# Altium schematic sheet [04]_Power Sheet.SchDoc
size Legal; DocumentNumber: 4; SheetNumber: 4; SheetTotal: 5
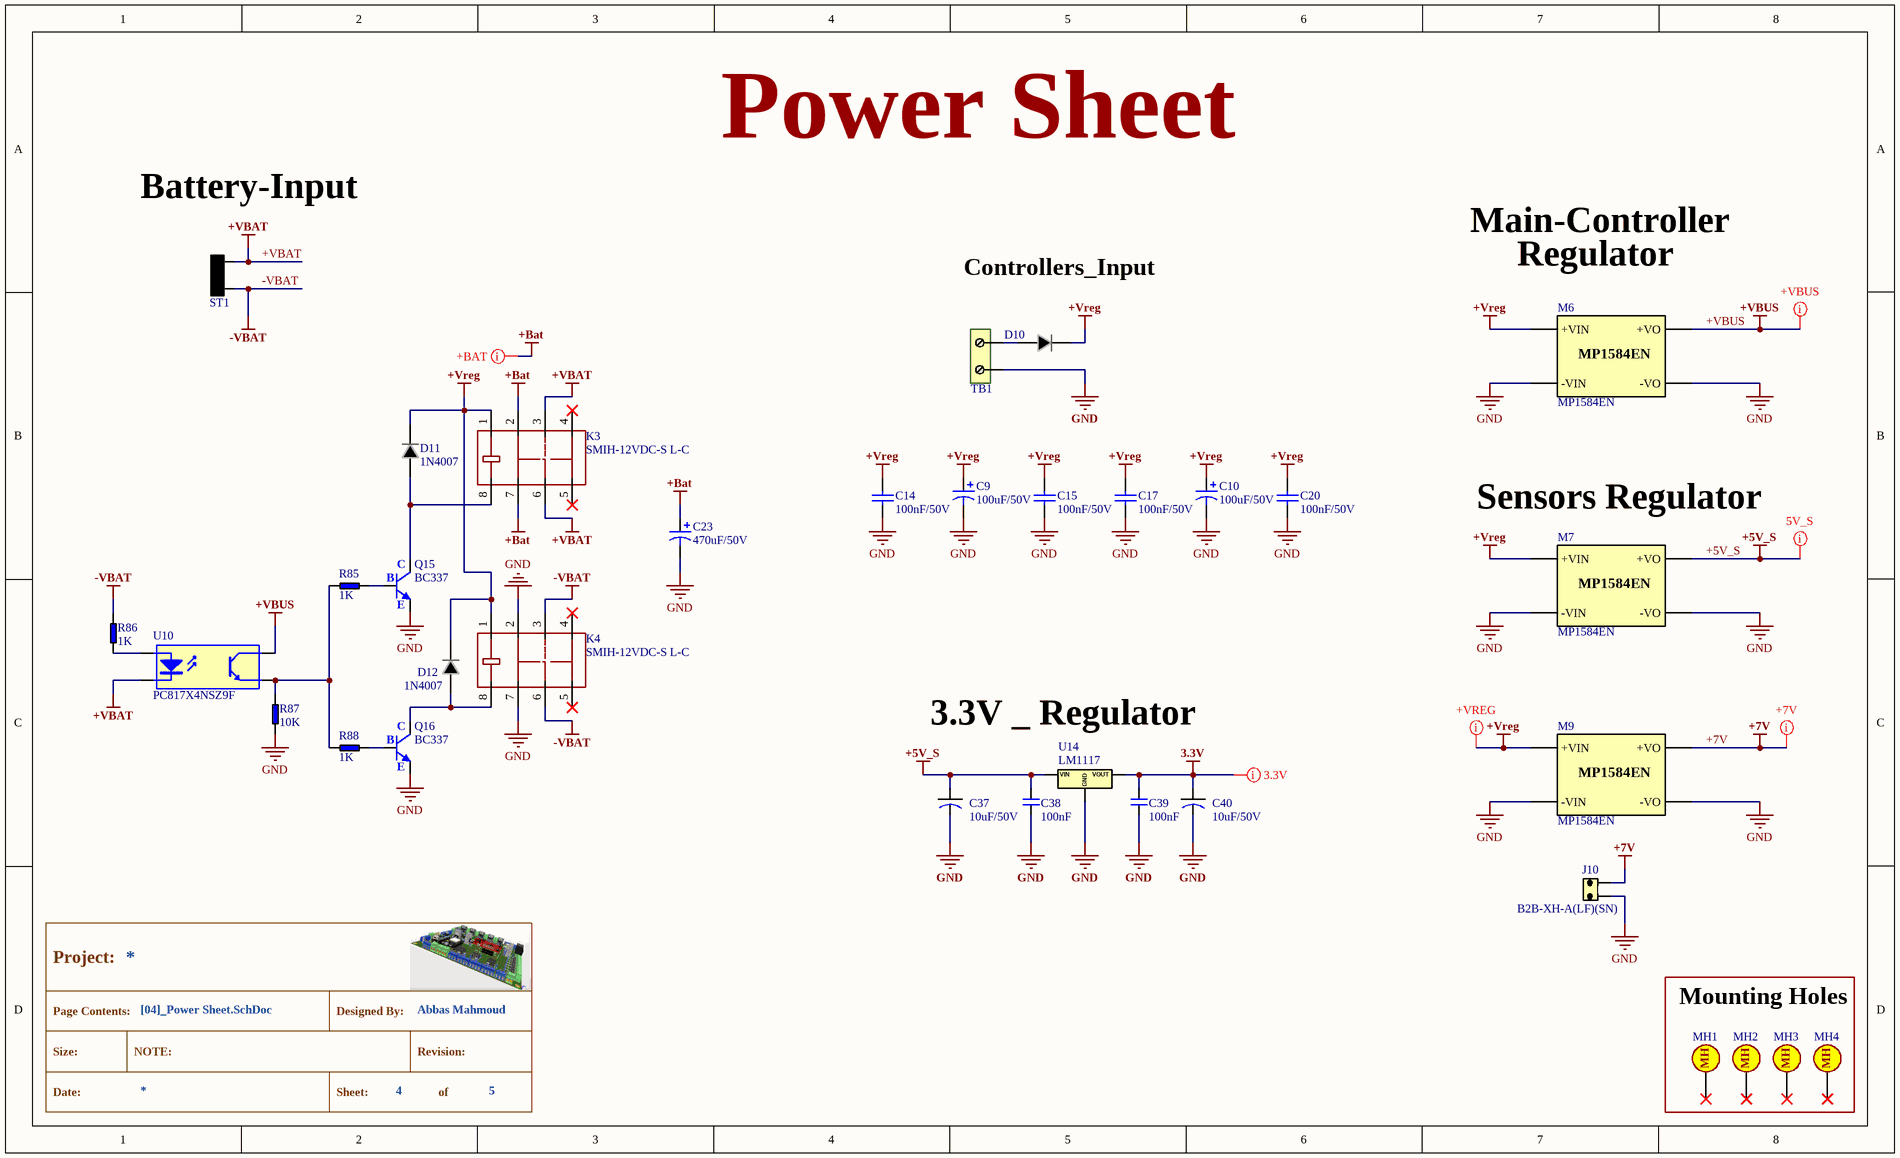
[diagram p0: [04]_Power Sheet.SchDoc]

## Parts
*  Title Block  (value not drawn)  (graphical)
C9  100uF/50V  [ECAP - THT - 8X12X3.5MM]
C10  100uF/50V  [ECAP - THT - 8X12X3.5MM]
C14  100nF/50V  [CCAP - PACKAGE - THT ,P = 2.54 MM]
C15  100nF/50V  [CCAP - PACKAGE - THT ,P = 2.54 MM]
C17  100nF/50V  [CCAP - PACKAGE - THT ,P = 2.54 MM]
C20  100nF/50V  [CCAP - PACKAGE - THT ,P = 2.54 MM]
C23  470uF/50V  [ECAP - THT - 10X20X5MM]
C37  10uF/50V  [ECAP 5X11X2MM]
C38  100nF  [CCAP 0.1 N Y]
C39  100nF  [CCAP 0.1 N Y]
C40  10uF/50V  [ECAP 5X11X2MM]
D10  1N4007  [DIODE - THT - 10.16P - PACKAGE - DO-41]  (value not drawn)
D11  1N4007  [DIODE - THT - 7.62P - PACKAGE - DO-41]
D12  1N4007  [DIODE - THT - 7.62P - PACKAGE - DO-41]
J10  B2B-XH-A(LF)(SN)  [XH - 2P - Vertical - Package - THT - P = 2.54]
K3  SMIH-12VDC-S L-C  [RELAY-TH_SMIH-12VDC-SL-C]
K4  SMIH-12VDC-S L-C  [RELAY-TH_SMIH-12VDC-SL-C]
M6  MP1584EN  [DC TO D CCONVERTER - MP1584]
M7  MP1584EN  [DC TO D CCONVERTER - MP1584]
M9  MP1584EN  [DC TO D CCONVERTER - MP1584]
MH1  MOUNTING HOLE  [MH-3.2X8mm_Round]  (value not drawn)  (no BOM)
MH2  MOUNTING HOLE  [MH-3.2X8mm_Round]  (value not drawn)  (no BOM)
MH3  MOUNTING HOLE  [MH-3.2X8mm_Round]  (value not drawn)  (no BOM)
MH4  MOUNTING HOLE  [MH-3.2X8mm_Round]  (value not drawn)  (no BOM)
Q15  BC337  [Transistor - THT - PACKAGE - TO-92 / TO-92-3]
Q16  BC337  [Transistor - THT - PACKAGE - TO-92 / TO-92-3]
R85  1K  [R - THT - P5.0 - 1/4W]
R86  1K  [R - THT - P5.0 - 1/4W]
R87  10K  [R - THT - P5.0 - 1/4W]
R88  1K  [R - THT - P5.0 - 1/4W]
ST1  SCREW TERMINAL  [SCREW TERMINAL]  (value not drawn)
TB1  2 Pins Pluggable  [TERMINAL BLOCK - 2 PINS - PACKAGE - PLUGGABLE - THT - P = 5.08MM - Horizontal _ Plug+Receptable]  (value not drawn)
U10  PC817X4NSZ9F  [ICB - DIP-4]
U14  LM1117  [V-REG/Heatsink - TO - 220]

## Blocks framed on the sheet
Mounting Holes: MH1-MH4

## Nets
3.3V: C39.1 C40.A U14.2(VOUT)
+5V_S: C37.A C38.1 M7.+VO U14.3(VIN)
+7V: J10.2 M9.+VO
+Bat: C23.A K3.2 K3.7
+VBAT: K3.3 K3.6 ST1.1(AC) U10.2(K)
+VBUS: M6.+VO U10.4(C)
+Vreg: C9.A C10.A C14.1 C15.1 C17.1 C20.1 D10.K D11.K D12.K K3.1 K4.1 M6.+VIN M7.+VIN M9.+VIN
-VBAT: K4.3 K4.6 R86.2 ST1.2(AC)
GND: C9.K C10.K C14.2 C15.2 C17.2 C20.2 C23.K C37.K C38.2 C39.2 C40.K J10.1 K4.2 K4.7 M6.-VIN M6.-VO M7.-VIN M7.-VO M9.-VIN M9.-VO Q15.1(E) Q16.1(E) R87.1 TB1.2 U14.1(GND)
NetD10_A: D10.A TB1.1
NetD11_A: D11.A K3.8 Q15.3(C)
NetD12_A: D12.A K4.8 Q16.3(C)
NetQ15_2: Q15.2(B) R85.2
NetQ16_2: Q16.2(B) R88.2
NetR85_1: R85.1 R87.2 R88.1 U10.3(E)
NetR86_1: R86.1 U10.1(A)

Not connected (* = marked no-connect by the designer): K3 4* 5*; K4 4* 5*; MH1 MH*; MH2 MH*; MH3 MH*; MH4 MH*

## Layout directives
rule Width Constraint [Pref Width = 5mm    Min Width = 0.5mm    Max Width = 5mm]: +Bat
rule Width Constraint [Pref Width = 2mm    Min Width = 2mm    Max Width = 2mm]: +Vreg
rule Width Constraint [Pref Width = 1.5mm    Min Width = 1.5mm    Max Width = 2mm]: 3.3V, +7V
rule Width Constraint [Pref Width = 1.5mm    Min Width = 0.5mm    Max Width = 2mm]: +VBUS
rule Width Constraint [Pref Width = 1.5mm    Min Width = 0.5mm    Max Width = 1.5mm]: +5V_S

## Notes on the sheet
- Power Sheet
- Battery-Input
- Main-Controller
- Controllers_Input
- Regulator
- (near M7) Sensors Regulator
- 3.3V _ Regulator
- (in symbol Title Block) Project:; Page Contents:; Designed By:; Abbas Mahmoud; Size:; NOTE:; Revision:; Date:; Sheet:; of

## Library data of the parts
* = Title Block: Moatley Title Block
C9 C10 = ECAP - 100uF - 50V: 100uF ±20% 50V 8x12 1000Hrs @ 105℃ Radial,8x12mm Aluminum Electrolytic Capacitors - Leaded RoHS
C14 C15 C17 C20 = CCAP - 100nF - 50V - THT - P = 2.54: 100nF -20%~+80% 50V Through Hole,P=2.54mm Ceramic Disc Capacitors RoHS; Parameter 1: *; Parameter 2: *; Parameter 3: *
C23 = ECAP - 470uF - 50V: 470uF ±20% 50V 10x20 1000Hrs @ 105℃ Radial,10x20mm Aluminum Electrolytic Capacitors - Leaded RoHS
C37 C40 = ECAP-10uF-50V: 10uF ±20% 50V 5x11 1000Hrs @ 105℃ Radial,5x11mm Aluminum Electrolytic Capacitors - Leaded RoHS
C38 C39 = Ceramic_CAP_100nF
D10-D12 = Diode - 1N4007 - THT: 1kV 1A 1V @ 1A DO-41 Diodes - General Purpose RoHS
J10 = XH - Male Header - 2P - THT - Vertical: XH Header Male Pin 0.098" (2.50mm) 2 Pins Through Hole,P=2.5mm Wire To Board / Wire To Wire Connector RoHS; Manufacturer: JST Sales America; Mfr.Part #: B2B-XH-A(LF)(SN); Package: Through Hole,P=2.5mm
K3 K4 = Relay_12V_16A: General Purpose Non Latching 12VDC SPDT 16A Through Hole Relays RoHS
M6 M7 M9 = DC TO DC CONVERTER - MP1584EN: DC-DC 4.5-28V to 0.8-20V Output 3A MP1584EN Step Down Buck Converter
MH1-MH4 = MH
Q15 Q16 = NPN - BC337: NPN 800mA 45V 625mW TO-92(TO-92-3) Transistors (NPN/PNP) RoHS
R85 R86 R88 = R1K - THT: 1K ±1% 1/4W ±100ppm/℃ Axial Metal Film Resistor_ Throuh Hole Technology RoHS
R87 = R10K - THT: 10K ±1% 1/4W ±100ppm/℃ Axial Metal Film Resistor_ Throuh Hole Technology RoHS
ST1 = SCREW TERMINAL: Barrier Terminal Block 2 Pin with cover 300V/25A
TB1 = Terminal Block - 2 Pins - Pluggable: Terminal Block 2 Pin 15A 300V  (28-14 AWG) P=5.08mm Through Hole Pluggable System Terminal Block RoHS
U10 = IC - PC817X4NSZ9F: Optoisolator Transistor Output 5000Vrms 1 Channel 4-DIP; Manufacturer: Sharp Microelectronics; Mfr.Part #: PC817X4NSZ9F; Package: DIP-4
U14 = LM117: IC LM1117-3.3V